# Altium schematic sheet AD9364_Interface.SchDoc
size C; DocumentNumber: 5; SheetNumber: 5
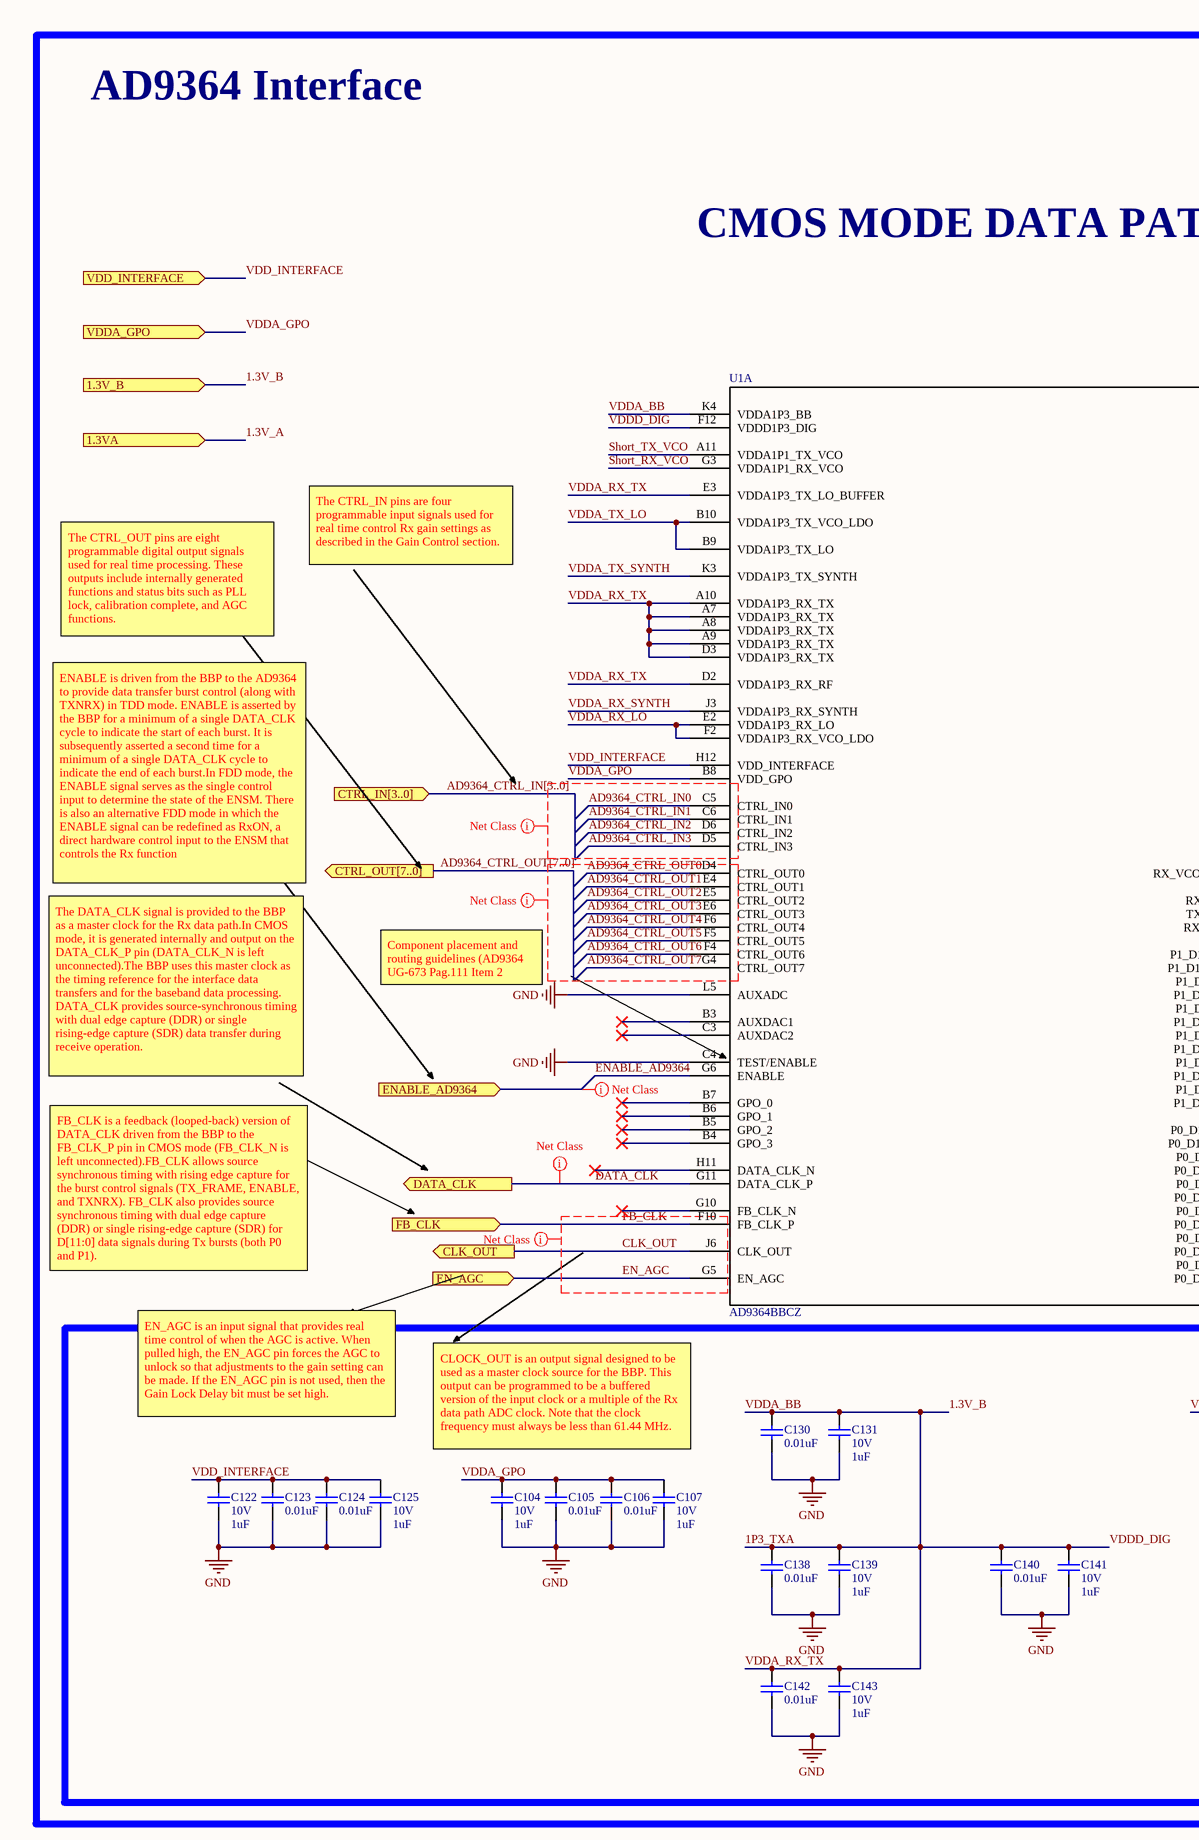
[diagram p0: AD9364_Interface.SchDoc, left]
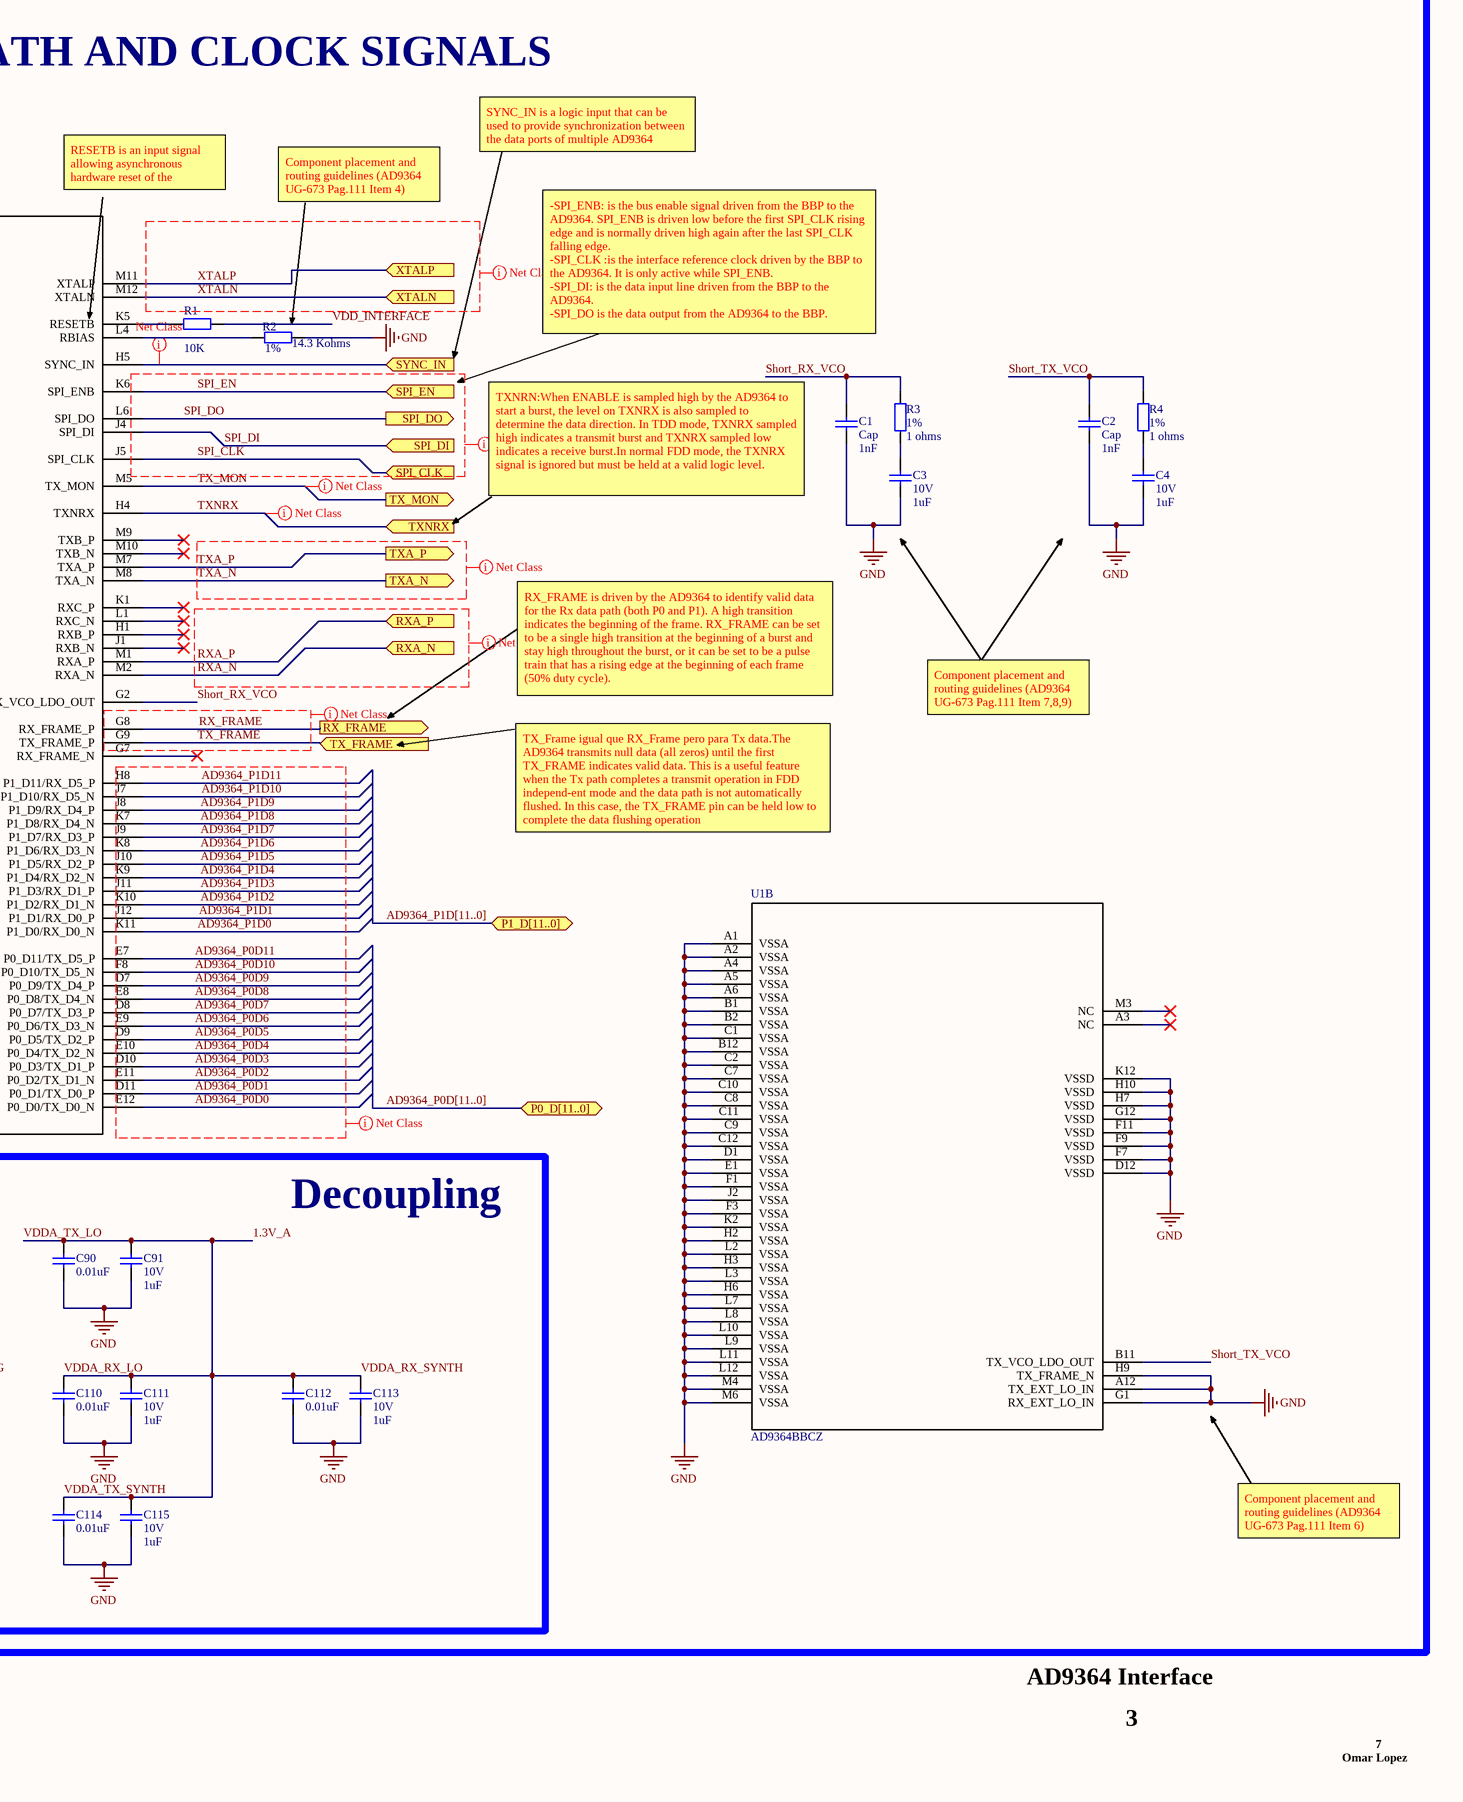
[diagram p1: AD9364_Interface.SchDoc, right]

## Parts
C1  Cap  value 1nF  [GRM0402MurataCap]
C2  Cap  value 1nF  [GRM0402MurataCap]
C3  10V  value 1uF  [GRM0402MurataCap]
C4  10V  value 1uF  [GRM0402MurataCap]
C90  value 0.01uF  [GRM0402MurataCap]  (hidden comment: Cap)
C91  10V  value 1uF  [GRM0402MurataCap]
C104  10V  value 1uF  [GRM0402MurataCap]
C105  value 0.01uF  [GRM0402MurataCap]  (hidden comment: Cap)
C106  value 0.01uF  [GRM0402MurataCap]  (hidden comment: Cap)
C107  10V  value 1uF  [GRM0402MurataCap]
C110  value 0.01uF  [GRM0402MurataCap]  (hidden comment: Cap)
C111  10V  value 1uF  [GRM0402MurataCap]
C112  value 0.01uF  [GRM0402MurataCap]  (hidden comment: Cap)
C113  10V  value 1uF  [GRM0402MurataCap]
C114  value 0.01uF  [GRM0402MurataCap]  (hidden comment: Cap)
C115  10V  value 1uF  [GRM0402MurataCap]
C122  10V  value 1uF  [GRM0402MurataCap]
C123  value 0.01uF  [GRM0402MurataCap]  (hidden comment: Cap)
C124  value 0.01uF  [GRM0402MurataCap]  (hidden comment: Cap)
C125  10V  value 1uF  [GRM0402MurataCap]
C130  value 0.01uF  [GRM0402MurataCap]  (hidden comment: Cap)
C131  10V  value 1uF  [GRM0402MurataCap]
C138  value 0.01uF  [GRM0402MurataCap]  (hidden comment: Cap)
C139  10V  value 1uF  [GRM0402MurataCap]
C140  value 0.01uF  [GRM0402MurataCap]  (hidden comment: Cap)
C141  10V  value 1uF  [GRM0402MurataCap]
C142  value 0.01uF  [GRM0402MurataCap]  (hidden comment: Cap)
C143  10V  value 1uF  [GRM0402MurataCap]
R1  value 10K  [RC0402N]
R2  1%  value 14.3 Kohms  [RC0402N]
R3  1%  value 1 ohms  [RC0402N]
R4  1%  value 1 ohms  [RC0402N]
U1  AD9364BBCZ  [BC_144_7_]  (parts A,B of 2)

## Blocks framed on the sheet
Decoupling: C90 C91 C104-C107 C110-C115 C122-C125 C130 C131 C138-C143

## Ports
1.3V_B (in), 1.3VA (in), CLK_OUT (out), CTRL_IN[3..0] (in), CTRL_OUT[7..0] (out), DATA_CLK (out), EN_AGC (in), ENABLE_AD9364 (in), FB_CLK (in), P0_D[11..0] (bidir), P1_D[11..0] (bidir), RX_FRAME (out), RXA_N (in), RXA_P (in), SPI_CLK (in), SPI_DI (in), SPI_DO (out), SPI_EN (in), SYNC_IN (in), TX_FRAME (in), TX_MON (out), TXA_N (out), TXA_P (out), TXNRX (in), VDD_INTERFACE (in), VDDA_GPO (in), XTALN (in), XTALP (in)

## Nets
GND: C1.2 C2.2 C3.2 C4.2 C90.1 C91.1 C104.1 C105.1 C106.1 C107.1 C110.1 C111.1 C112.1 C113.1 C114.1 C115.1 C122.1 C123.1 C124.1 C125.1 C130.1 C131.1 C138.1 C139.1 C140.1 C141.1 C142.1 C143.1 R2.1 U1.A1(VSSA) U1.A2(VSSA) U1.A4(VSSA) U1.A5(VSSA) U1.A6(VSSA) U1.A12(TX_EXT_LO_IN) U1.B1(VSSA) U1.B2(VSSA) U1.B12(VSSA) U1.C1(VSSA) U1.C2(VSSA) U1.C4(TEST/ENABLE) U1.C7(VSSA) U1.C8(VSSA) U1.C9(VSSA) U1.C10(VSSA) U1.C11(VSSA) U1.C12(VSSA) U1.D1(VSSA) U1.D12(VSSD) U1.E1(VSSA) U1.F1(VSSA) U1.F3(VSSA) U1.F7(VSSD) U1.F9(VSSD) U1.F11(VSSD) U1.G1(RX_EXT_LO_IN) U1.G12(VSSD) U1.H2(VSSA) U1.H3(VSSA) U1.H6(VSSA) U1.H7(VSSD) U1.H9(TX_FRAME_N) U1.H10(VSSD) U1.J2(VSSA) U1.K2(VSSA) U1.K12(VSSD) U1.L2(VSSA) U1.L3(VSSA) U1.L5(AUXADC) U1.L7(VSSA) U1.L8(VSSA) U1.L9(VSSA) U1.L10(VSSA) U1.L11(VSSA) U1.L12(VSSA) U1.M4(VSSA) U1.M6(VSSA)
1.3V_A: C90.2 C91.2 C110.2 C111.2 C112.2 C113.2 C114.2 C115.2 U1.B9(VDDA1P3_TX_LO) U1.B10(VDDA1P3_TX_VCO_LDO) U1.E2(VDDA1P3_RX_LO) U1.F2(VDDA1P3_RX_VCO_LDO) U1.J3(VDDA1P3_RX_SYNTH) U1.K3(VDDA1P3_TX_SYNTH) ; port 1.3VA  [also labelled VDDA_RX_LO, VDDA_RX_SYNTH, VDDA_TX_LO, VDDA_TX_SYNTH]
1.3V_B: C130.2 C131.2 C138.2 C139.2 C140.2 C141.2 C142.2 C143.2 U1.A7(VDDA1P3_RX_TX) U1.A8(VDDA1P3_RX_TX) U1.A9(VDDA1P3_RX_TX) U1.A10(VDDA1P3_RX_TX) U1.D2(VDDA1P3_RX_RF) U1.D3(VDDA1P3_RX_TX) U1.E3(VDDA1P3_TX_LO_BUFFER) U1.F12(VDDD1P3_DIG) U1.K4(VDDA1P3_BB) ; port 1.3V_B  [also labelled 1P3_TXA, VDDA_BB, VDDA_RX_TX, VDDD_DIG]
AD9364_CTRL_IN0: U1.C5(CTRL_IN0)
AD9364_CTRL_IN1: U1.C6(CTRL_IN1)
AD9364_CTRL_IN2: U1.D6(CTRL_IN2)
AD9364_CTRL_IN3: U1.D5(CTRL_IN3)
AD9364_CTRL_OUT0: U1.D4(CTRL_OUT0)
AD9364_CTRL_OUT1: U1.E4(CTRL_OUT1)
AD9364_CTRL_OUT2: U1.E5(CTRL_OUT2)
AD9364_CTRL_OUT3: U1.E6(CTRL_OUT3)
AD9364_CTRL_OUT4: U1.F6(CTRL_OUT4)
AD9364_CTRL_OUT5: U1.F5(CTRL_OUT5)
AD9364_CTRL_OUT6: U1.F4(CTRL_OUT6)
AD9364_CTRL_OUT7: U1.G4(CTRL_OUT7)
AD9364_P0D0: U1.E12(P0_D0/TX_D0_N)
AD9364_P0D1: U1.D11(P0_D1/TX_D0_P)
AD9364_P0D2: U1.E11(P0_D2/TX_D1_N)
AD9364_P0D3: U1.D10(P0_D3/TX_D1_P)
AD9364_P0D4: U1.E10(P0_D4/TX_D2_N)
AD9364_P0D5: U1.D9(P0_D5/TX_D2_P)
AD9364_P0D6: U1.E9(P0_D6/TX_D3_N)
AD9364_P0D7: U1.D8(P0_D7/TX_D3_P)
AD9364_P0D8: U1.E8(P0_D8/TX_D4_N)
AD9364_P0D9: U1.D7(P0_D9/TX_D4_P)
AD9364_P0D10: U1.F8(P0_D10/TX_D5_N)
AD9364_P0D11: U1.E7(P0_D11/TX_D5_P)
AD9364_P1D0: U1.K11(P1_D0/RX_D0_N)
AD9364_P1D1: U1.J12(P1_D1/RX_D0_P)
AD9364_P1D2: U1.K10(P1_D2/RX_D1_N)
AD9364_P1D3: U1.J11(P1_D3/RX_D1_P)
AD9364_P1D4: U1.K9(P1_D4/RX_D2_N)
AD9364_P1D5: U1.J10(P1_D5/RX_D2_P)
AD9364_P1D6: U1.K8(P1_D6/RX_D3_N)
AD9364_P1D7: U1.J9(P1_D7/RX_D3_P)
AD9364_P1D8: U1.K7(P1_D8/RX_D4_N)
AD9364_P1D9: U1.J8(P1_D9/RX_D4_P)
AD9364_P1D10: U1.J7(P1_D10/RX_D5_N)
AD9364_P1D11: U1.H8(P1_D11/RX_D5_P)
CLK_OUT: U1.J6(CLK_OUT) ; port CLK_OUT
DATA_CLK: U1.G11(DATA_CLK_P) ; port DATA_CLK
EN_AGC: U1.G5(EN_AGC) ; port EN_AGC
ENABLE_AD9364: U1.G6(ENABLE) ; port ENABLE_AD9364
FB_CLK: U1.F10(FB_CLK_P) ; port FB_CLK
RX_FRAME: U1.G8(RX_FRAME_P) ; port RX_FRAME
RXA_N: U1.M2(RXA_N) ; port RXA_N
RXA_P: U1.M1(RXA_P) ; port RXA_P
Short_RX_VCO: C1.1 R3.1 U1.G2(RX_VCO_LDO_OUT) U1.G3(VDDA1P1_RX_VCO)
Short_TX_VCO: C2.1 R4.1 U1.A11(VDDA1P1_TX_VCO) U1.B11(TX_VCO_LDO_OUT)
SPI_CLK: U1.J5(SPI_CLK) ; port SPI_CLK
SPI_DI: U1.J4(SPI_DI) ; port SPI_DI
SPI_DO: U1.L6(SPI_DO) ; port SPI_DO
SPI_EN: U1.K6(SPI_ENB) ; port SPI_EN
SYNC_IN: U1.H5(SYNC_IN) ; port SYNC_IN
TX_FRAME: U1.G9(TX_FRAME_P) ; port TX_FRAME
TX_MON: U1.M5(TX_MON) ; port TX_MON
TXA_N: U1.M8(TXA_N) ; port TXA_N
TXA_P: U1.M7(TXA_P) ; port TXA_P
TXNRX: U1.H4(TXNRX) ; port TXNRX
VDD_INTERFACE: C122.2 C123.2 C124.2 C125.2 R1.1 U1.H12(VDD_INTERFACE) ; port VDD_INTERFACE
VDDA_GPO: C104.2 C105.2 C106.2 C107.2 U1.B8(VDD_GPO) ; port VDDA_GPO
XTALN: U1.M12(XTALN) ; port XTALN
XTALP: U1.M11(XTALP) ; port XTALP
NetC3_1: C3.1 R3.2
NetC4_1: C4.1 R4.2
NetR1_2: R1.2 U1.K5(RESETB)
NetR2_2: R2.2 U1.L4(RBIAS)

Not connected (* = marked no-connect by the designer): U1 A3(NC)* B3(AUXDAC1)* B4(GPO_3)* B5(GPO_2)* B6(GPO_1)* B7(GPO_0)* C3(AUXDAC2)* G7(RX_FRAME_N)* G10(FB_CLK_N)* H1(RXB_P)* H11(DATA_CLK_N)* J1(RXB_N)* K1(RXC_P)* L1(RXC_N)* M3(NC)* M9(TXB_P)* M10(TXB_N)*

## Buses and harness runs
bus AD9364_CTRL_IN[3..0] = port CTRL_IN[3..0]
bus AD9364_CTRL_OUT[7..0] = port CTRL_OUT[7..0]
bus AD9364_P0D[11..0] = port P0_D[11..0]
bus AD9364_P1D[11..0] = port P1_D[11..0]

## Layout directives
net class AD9364_Digital; net class AD9364_DataPorts: AD9364_P0D0, AD9364_P0D1, AD9364_P0D2, AD9364_P0D3, AD9364_P0D4, AD9364_P0D5, AD9364_P0D6, AD9364_P0D7, AD9364_P0D8, AD9364_P0D9, AD9364_P0D10, AD9364_P0D11, AD9364_P1D0, AD9364_P1D1, AD9364_P1D2, AD9364_P1D3, AD9364_P1D4, AD9364_P1D5, AD9364_P1D6, AD9364_P1D7, AD9364_P1D8, AD9364_P1D9, AD9364_P1D10, AD9364_P1D11
net class AD9364_Digital; net class AD9364_CTRL_OUT[7..0]: AD9364_CTRL_OUT0, AD9364_CTRL_OUT1, AD9364_CTRL_OUT2, AD9364_CTRL_OUT3, AD9364_CTRL_OUT4, AD9364_CTRL_OUT5, AD9364_CTRL_OUT6, AD9364_CTRL_OUT7
net class AD9364_Digital; net class AD9364_SPI_4Wires: SPI_CLK, SPI_DI, SPI_DO, SPI_EN
net class AD9364_Digital; net class AD9364_Other: CLK_OUT, DATA_CLK, EN_AGC, ENABLE_AD9364, FB_CLK, RX_FRAME, SYNC_IN, TX_FRAME, TXNRX
net class AD9364_Digital; net class AD9364_CTRL_IN[3..0]: AD9364_CTRL_IN0, AD9364_CTRL_IN1, AD9364_CTRL_IN2, AD9364_CTRL_IN3
net class AD9364_RF; net class AD9364_Clock: XTALN, XTALP
net class AD9364_RF; net class AD9364_Rx: RXA_N, RXA_P
net class AD9364_RF; net class AD9364_TxMon: TX_MON
net class AD9364_RF; net class AD9364_Tx: TXA_N, TXA_P

## Notes on the sheet
- AD9364 Interface
- CMOS MODE DATA PATH AND CLOCK SIGNALS
- SYNC_IN is a logic input that can be used to provide synchronization between the data ports of multiple AD9364 devices.
- RESETB is an input signal allowing asynchronous hardware reset of the AD9364.
- Component placement and routing guidelines (AD9364 UG-673 Pag.111 Item 4)
- -SPI_ENB: is the bus enable signal driven from the BBP to the AD9364. SPI_ENB is driven low before the first SPI_CLK rising edge and is normally driven high again after the last SPI_CLK falling edge.
  -SPI_CLK :is the interface reference clock driven by the BBP to the AD9364. It is only active while SPI_ENB.
  -SPI_DI: is the data input line driven from the BBP to the AD9364.
  -SPI_DO is the data output from the AD9364 to the BBP.
- The CTRL_IN pins are four programmable input signals used for real time control Rx gain settings as described in the Gain Control section.
- The CTRL_OUT pins are eight programmable digital output signals used for real time processing. These outputs include internally generated functions and status bits such as PLL lock, calibration complete, and AGC functions.
- (near C1) TXNRN:When ENABLE is sampled high by the AD9364 to start a burst, the level on TXNRX is also sampled to determine the data direction. In TDD mode, TXNRX sampled high indicates a transmit burst and TXNRX sampled low indicates a receive burst.In normal FDD mode, the TXNRX signal is ignored but must be held at a valid logic level.
- ENABLE is driven from the BBP to the AD9364 to provide data transfer burst control (along with TXNRX) in TDD mode. ENABLE is asserted by the BBP for a minimum of a single DATA_CLK cycle to indicate the start of each burst. It is subsequently asserted a second time for a minimum of a single DATA_CLK cycle to indicate the end of each burst.In FDD mode, the ENABLE signal serves as the single control input to determine the state of the ENSM. There is also an alternative FDD mode in which the ENABLE signal can be redefined as RxON, a direct hardware control input to the ENSM that controls the Rx function
- RX_FRAME is driven by the AD9364 to identify valid data for the Rx data path (both P0 and P1). A high transition indicates the beginning of the frame. RX_FRAME can be set to be a single high transition at the beginning of a burst and stay high throughout the burst, or it can be set to be a pulse train that has a rising edge at the beginning of each frame (50% duty cycle).
- Component placement and routing guidelines (AD9364 UG-673 Pag.111 Item 7,8,9)
- Component placement and routing guidelines (AD9364 UG-673 Pag.111 Item 2
  )
- TX_Frame igual que RX_Frame pero para Tx data.The AD9364 transmits null data (all zeros) until the first TX_FRAME indicates valid data. This is a useful feature when the Tx path completes a transmit operation in FDD independ-ent mode and the data path is not automatically flushed. In this case, the TX_FRAME pin can be held low to complete the data flushing operation
- The DATA_CLK signal is provided to the BBP as a master clock for the Rx data path.In CMOS mode, it is generated internally and output on the DATA_CLK_P pin (DATA_CLK_N is left unconnected).The BBP uses this master clock as the timing reference for the interface data transfers and for the baseband data processing. DATA_CLK provides source-synchronous timing with dual edge capture (DDR) or single rising-edge capture (SDR) data transfer during receive operation.
- FB_CLK is a feedback (looped-back) version of DATA_CLK driven from the BBP to the FB_CLK_P pin in CMOS mode (FB_CLK_N is left unconnected).FB_CLK allows source synchronous timing with rising edge capture for the burst control signals (TX_FRAME, ENABLE, and TXNRX). FB_CLK also provides source synchronous timing with dual edge capture (DDR) or single rising-edge capture (SDR) for D[11:0] data signals during Tx bursts (both P0 and P1).
- EN_AGC is an input signal that provides real time control of when the AGC is active. When pulled high, the EN_AGC pin forces the AGC to unlock so that adjustments to the gain setting can be made. If the EN_AGC pin is not used, then the Gain Lock Delay bit must be set high.
- CLOCK_OUT is an output signal designed to be used as a master clock source for the BBP. This output can be programmed to be a buffered version of the input clock or a multiple of the Rx data path ADC clock. Note that the clock frequency must always be less than 61.44 MHz.
- Component placement and routing guidelines (AD9364 UG-673 Pag.111 Item 6)
- 3
- Omar Lopez
- 7

## Library data of the parts
C1 C2 = Cap: Capacitor; Manufacturer: Murata; PartNumber: GRM1555C1H102FA01D; Tolerance: 10%; Descripción: 50V SMD; CostoVendedor1: 0.25; Vendedor1: Mouser; Vendedor2: Digi-Key; Package: 0402; DataSheet: http://www.mouser.com/ds/2/281/c02e-2905.pdf; LinkVendedor1: https://ar.mouser.com/ProductDetail/Murata-Electronics/GRM1555C1H102FA01D?qs=sGAEpiMZZMs0AnBnWHyRQHS%2f3XE0oMwxlJflngdMc0Y%3d; Stock1: 95000
C3 C4 C91 C104 C107 C111 C113 C115 C122 C125 C131 C139 C141 C143 = Cap: Capacitor; Manufacturer: Murata; PartNumber: GRM155C81E105KE11D; Tolerance: 10%; Descripción: SMD/SMT 0402 1uF 6.3volts X5R 10%; CostoVendedor2: 0.3; Vendedor1: Mouser; Vendedor2: Digi-Key; Package: 0402; DataSheet: http://www.mouser.com/ds/2/281/c02e-2905.pdf; LinkVendedor2: https://www.digikey.com/product-detail/en/murata-electronics-north-america/GRM155C81E105KE11D/490-10014-1-ND/5026352; Stock2: 4000
C90 C105 C106 C110 C112 C114 C123 C124 C130 C138 C140 C142 = Cap: Capacitor; Manufacturer: Murata; PartNumber: GCG155L81E103KA01D; Tolerance: 10%; Descripción: SMD/SMT 0402 0.01uF 25volts X7R 10%; CostoVendedor1: 0.19; Vendedor1: Mouser; Vendedor2: Digi-Key; Package: 0402; DataSheet: https://ar.mouser.com/datasheet/2/281/c03e-516224.pdf; LinkVendedor1: https://ar.mouser.com/ProductDetail/Murata-Electronics/GCG155L81E103KA01D?qs=sGAEpiMZZMs0AnBnWHyRQID2xuQsFd1G0H3MNkFLCyvrnbiUuoaHUg%3d%3d; Stock1: 8800
R1 = Res2: Resistor; Manufacturer: Panasonic; PartNumber: ERJ-2RKF1002X; Tolerance: 1%; Descripción: 100mW 50V; CostoVendedor1: 0.021; Vendedor1: Mouser; Vendedor2: Digi-Key; Package: 0402; DataSheet: http://www.mouser.com/ds/2/315/AOA0000C86-911473.pdf; LinkVendedor1: https://ar.mouser.com/ProductDetail/Panasonic-Industrial-Devices/ERJ-2RKF1002X?qs=%2fha2pyFadujciewGcSbxYCeocmJ1V0ffuiBNpRUU2nm5e2XaRJ685Q%3d%3d; Stock1: 2000000
R2 = Res2: Resistor; Manufacturer: Panasonic; PartNumber: ERJ-2RKF1432X; Descripción: 100mw 50V; Vendedor1: Mouser; Vendedor2: Digi-Key; Package: 0402; Tolerance: 1%; DataSheet: http://www.mouser.com/ds/2/315/AOA0000C283-1093288.pdf
R3 R4 = Res2: Resistor; Manufacturer: Panasonic; PartNumber: ERJ-2BQJ1R0X; Tolerance: 5%; Descripción: Resistores de detección de corriente - SMD Thick Film Chip R, 0402, Low ohmic, 5%; CostoVendedor1: 0.37; Vendedor1: Mouser; Vendedor2: Digi-Key; Package: 0402; DataSheet: http://www.mouser.com/ds/2/315/AOA0000C283-1093288.pdf; LinkVendedor1: https://ar.mouser.com/ProductDetail/Panasonic/ERJ-2BQJ1R0X?qs=sGAEpiMZZMtlleCFQhR%2fzZ0wbLhD%252bede7FN8GfckIhM%3d; Stock1: 8500
U1 = AD9364BBCZ: Transceiver; Manufacturer: Analog Devices; CostoVendedor1: 176; CostoVendedor2: 200; Requerimiento: Disponible 26 de Julio; Vendedor1: Mouser; Vendedor2: Digi-Key; Value: Value; DataSheet: http://www.mouser.com/ds/2/609/AD9364-586828.pdf; Descripción: Transceiver; PartNumber: AD9364BBCZ; LinkVendedor1: https://ar.mouser.com/ProductDetail/Analog-Devices/AD9364BBCZ?qs=sGAEpiMZZMt%252bz66QWnul0XZd%2fXb1tNSbHpa03Fwpc7M%3d; LinkVendedor2: https://www.digikey.com/product-detail/en/analog-devices-inc/AD9364BBCZ/AD9364BBCZ-ND/4747823?utm_campaign=buynow&utm_medium=aggregator&WT.z_cid=ref_findchips_standard&utm_source=findchips; Stock1: 0; Stock2: 508